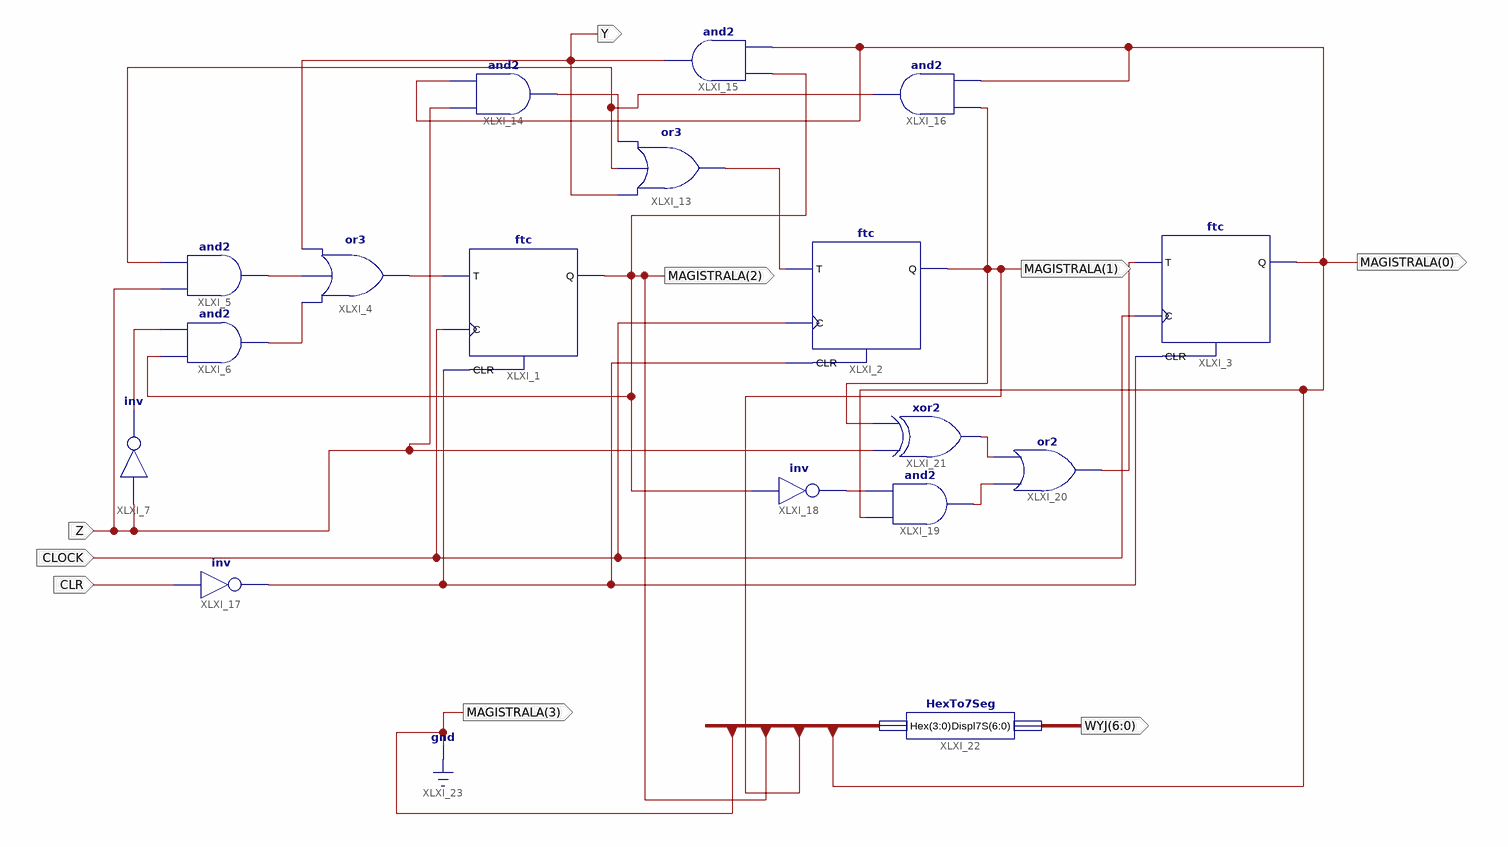
[diagram p0: schematic sheet 1]
// Xilinx ISE schematic scheme.sch (xc9500xl) as structural Verilog: 17 symbols, 9 ports
module scheme (
  input  Z,
  input  CLR,
  input  CLOCK,
  output Y,
  output [3:0] MAGISTRALA,
  output [6:0] WYJ
);

  wire XLXN_1, XLXN_2, XLXN_3, XLXN_4, XLXN_5, XLXN_8, XLXN_9, XLXN_10, XLXN_11, XLXN_22, XLXN_27, XLXN_45;

  ftc XLXI_2 (.C(CLOCK), .CLR(XLXN_27), .T(XLXN_4), .Q(MAGISTRALA[1]));
  ftc XLXI_3 (.C(CLOCK), .CLR(XLXN_27), .T(XLXN_22), .Q(MAGISTRALA[0]));
  ftc XLXI_1 (.C(CLOCK), .CLR(XLXN_27), .T(XLXN_1), .Q(MAGISTRALA[2]));
  or XLXI_4 (XLXN_1, XLXN_3, XLXN_2, Y);
  and XLXI_5 (XLXN_2, Z, XLXN_45);
  and XLXI_6 (XLXN_3, MAGISTRALA[2], XLXN_10);
  not XLXI_7 (XLXN_10, Z);
  and XLXI_14 (XLXN_5, Z, MAGISTRALA[0]);
  or XLXI_13 (XLXN_4, Y, XLXN_45, XLXN_5);
  and XLXI_16 (XLXN_45, MAGISTRALA[0], MAGISTRALA[1]);
  and XLXI_15 (Y, MAGISTRALA[0], MAGISTRALA[2]);
  not XLXI_17 (XLXN_27, CLR);
  xor XLXI_21 (XLXN_8, Z, MAGISTRALA[1]);
  and XLXI_19 (XLXN_9, MAGISTRALA[0], XLXN_11);
  not XLXI_18 (XLXN_11, MAGISTRALA[2]);
  or XLXI_20 (XLXN_22, XLXN_9, XLXN_8);
  HexTo7Seg XLXI_22 (.Hex({1'b0, MAGISTRALA[2:0]}), .Displ7S(WYJ));

  assign MAGISTRALA[3] = 1'b0;
endmodule
